# EAGLE design bpf-IF-SAW-856930 (EAGLE 9.2.2)
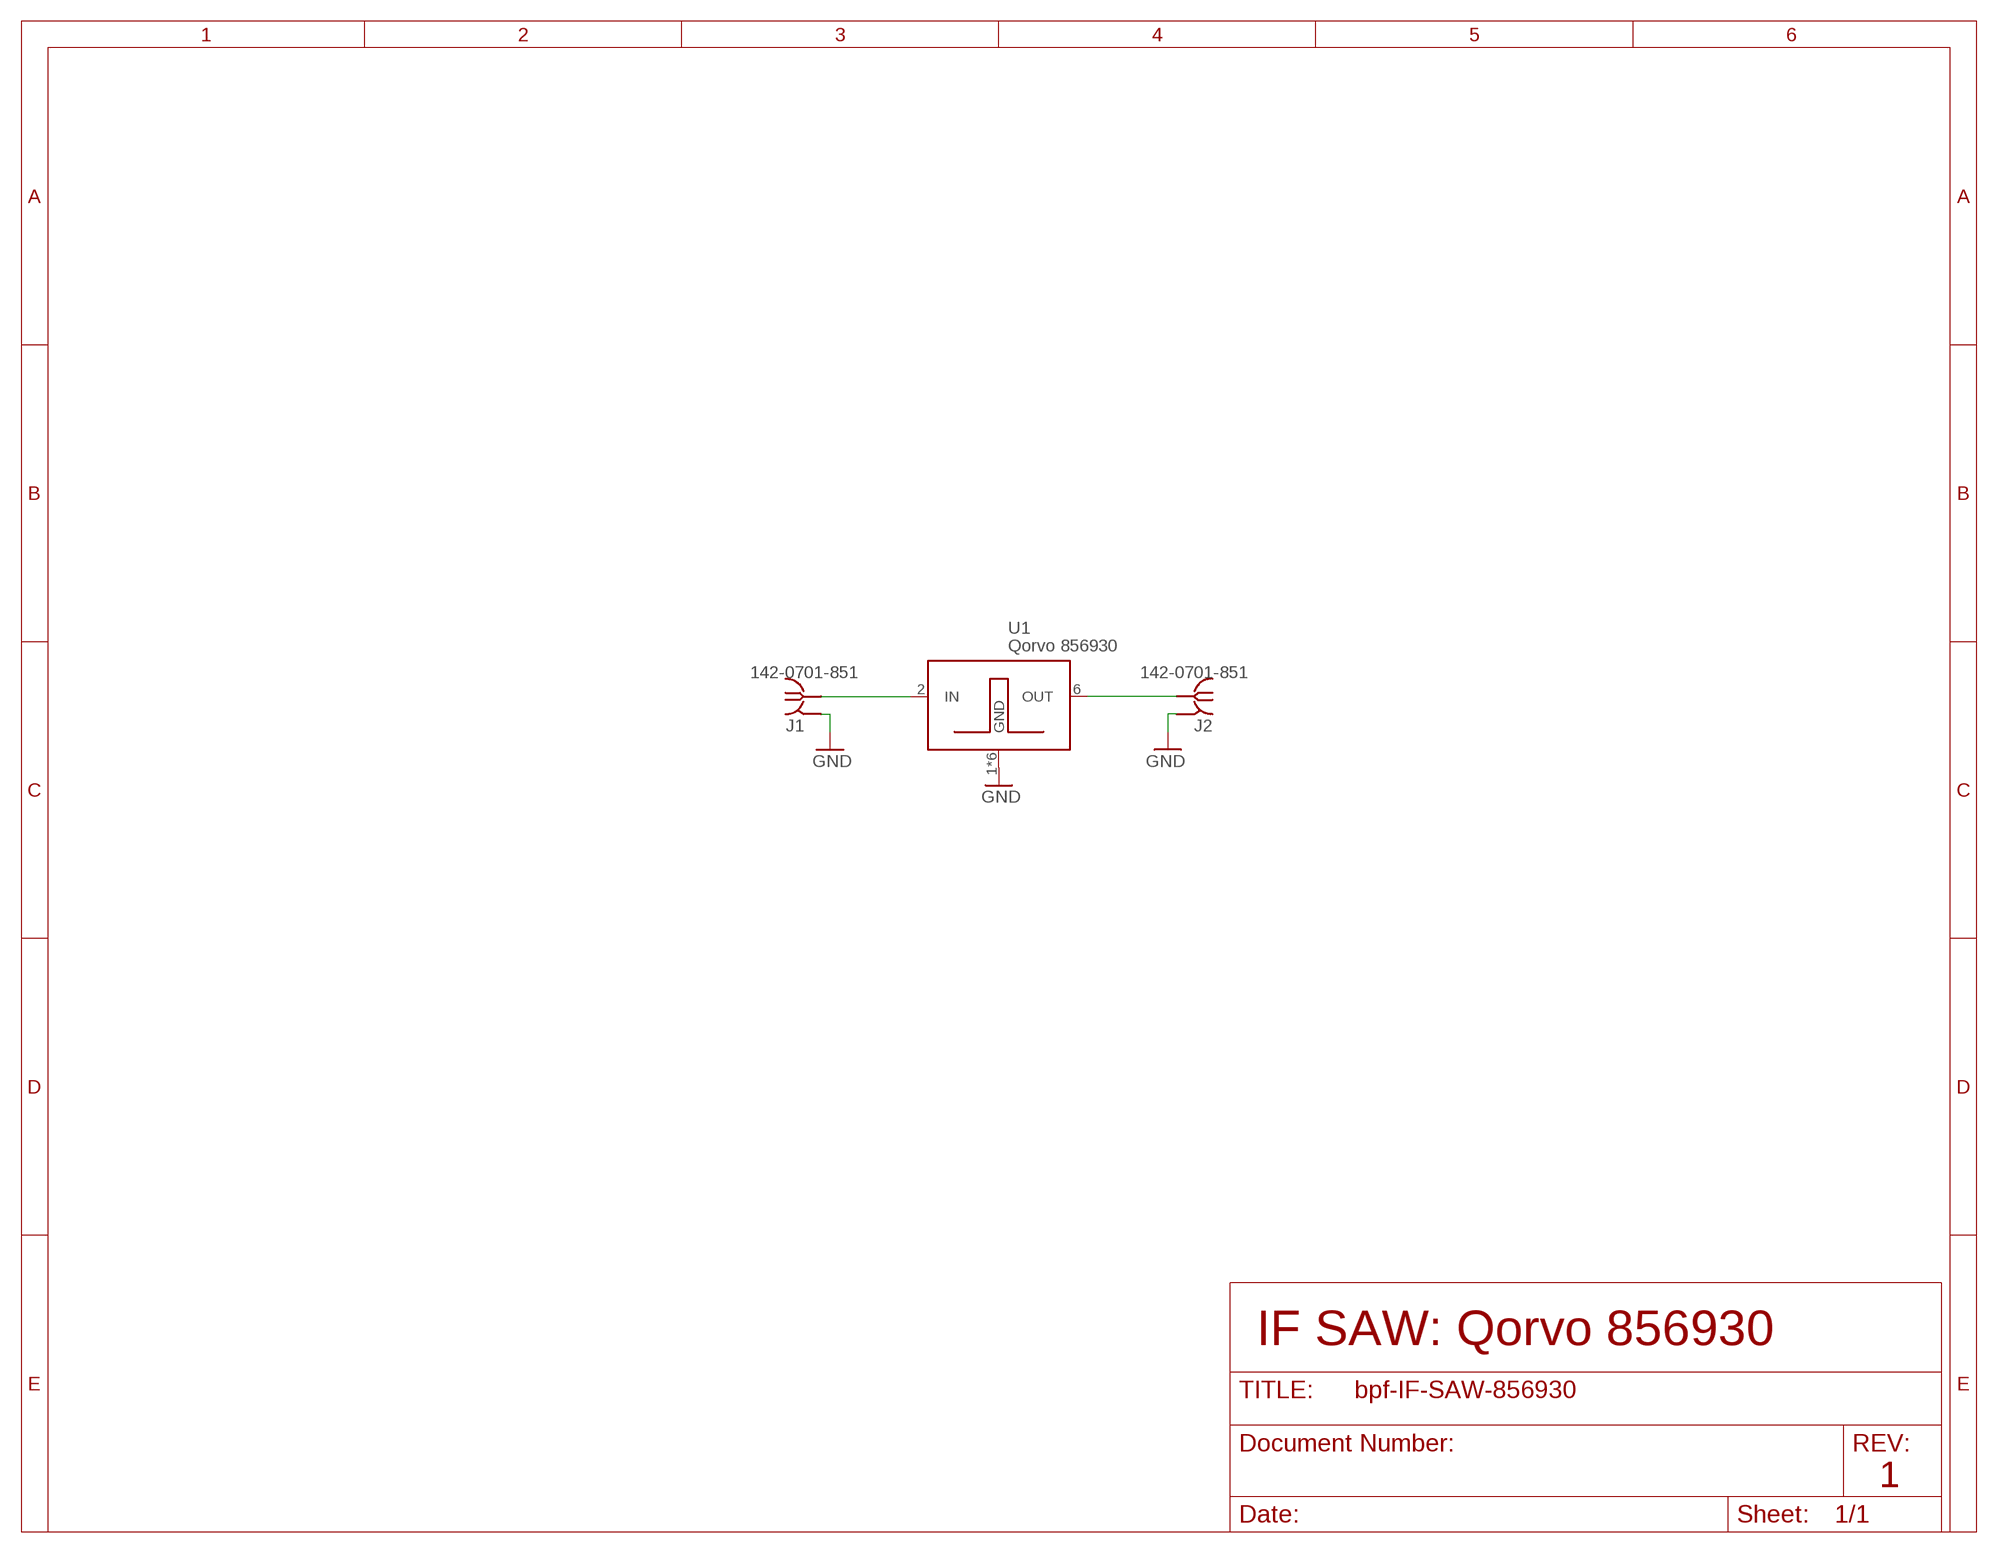
[diagram p0: schematic, sheet 1]

## Parts
J1  142-0701-851  [142-0701-851]
J2  142-0701-851  [142-0701-851]
U1  Qorvo 856930  856930  [3.8X3.8]

## Nets
GND: J1.GND1(GND) J1.GND2(GND) J1.GND3(GND) J1.GND4(GND) J2.GND1(GND) J2.GND2(GND) J2.GND3(GND) J2.GND4(GND) U1.1(GND) U1.3(GND) U1.4(GND) U1.5(GND) U1.7(GND) U1.8(GND)
N$86 [RF]: J1.RF1(RF) U1.2(IN)
N$87 [RF]: J2.RF1(RF) U1.6(OUT)

## Notes on the sheet
- IF SAW: Qorvo 856930
- 1

## Library data of the parts
J1 J2 = J-Cinch-142-0701-851-SMA-end-launch:142-0701-851: SMA Jack 50Ω - End Launch Source: Datasheet <https://belfuse.com/resources/productinformations/cinchconnectivitysolutions/johnson/pi-ccs-john-142-0701-851.pdf>
U1 = U-Qorvo-856930-SAW:856930: 457.5 MHz SAW Filter

## Net classes
1 RF: clearance 0.6 mm

## Board
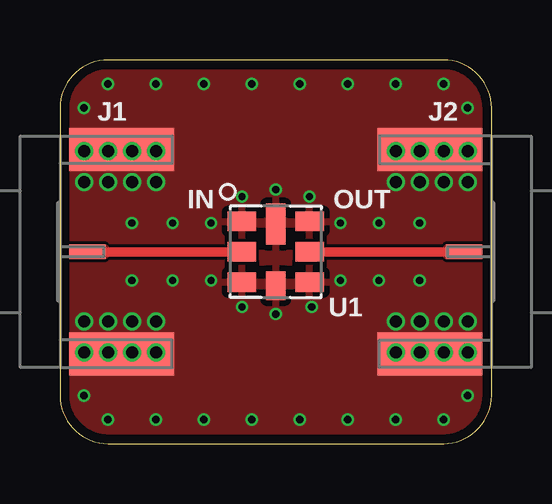
[diagram p1: board, top side]
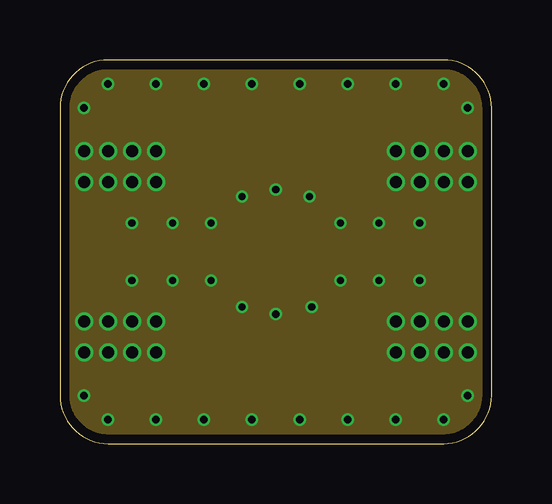
[diagram p2: board, inner layer Route2]
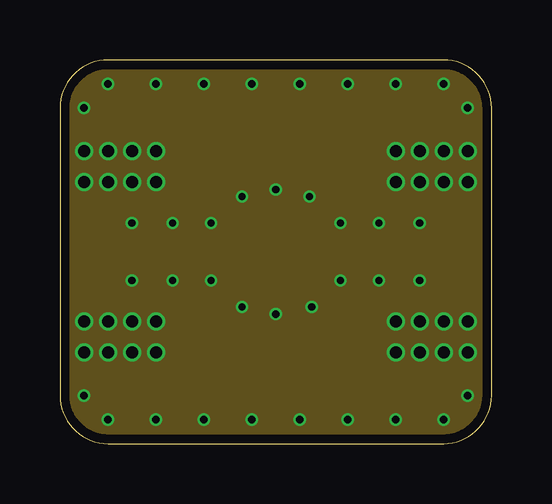
[diagram p3: board, inner layer Route15]
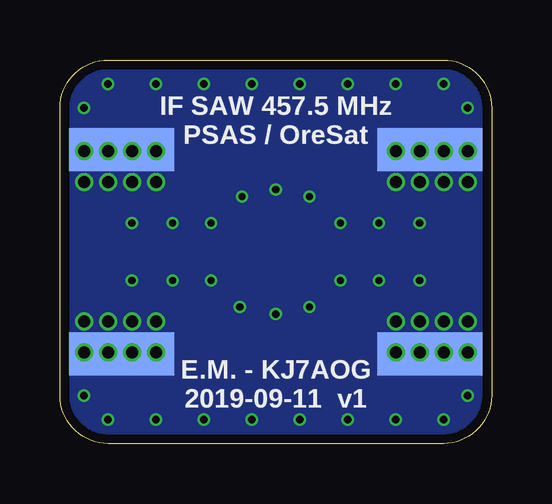
[diagram p4: board, bottom side, seen from below]

Size 18 x 16 mm. Coordinates in mm from the lower left corner, seen from the top.
Outline: 16,16 2,16 arc90 0,14 0,2 arc90 2,0 16,0 arc90 18,2 18,14 arc90 16,16
Copper layers (1*2*15*16): Top 0.035559375mm / dielectric 0.17018125mm / Route2 0.01778125mm / dielectric 47mil / Route15 0.01778125mm / dielectric 0.17018125mm / Bottom 0.035559375mm
Design rules "oshpark-4layer-tented": minimum track width 5mil, minimum drill 10mil, track to track 5mil, track to pad 5mil, pad to pad 5mil, via to via 5mil, smd to smd 5mil, copper to edge 15mil, drill to drill 6mil, minimum pad ring 4mil, minimum via ring 4mil, stop-mask expansion 2.5mil, vias tented up to drill 20mil, thermal gap 10mil

### Footprints (pad centres in the part's own frame; a part is rotated, then mirrored left to right if it is on the bottom)
142-0701-851 = smd 1.8 x 4.37: GND1 -4.255,-2.566; GND2 4.255,-2.566 | smd 1.8 x 4.37 bottom: GND3 -4.255,-2.566; GND4 4.255,-2.566 | smd 0.6 x 1.53: RF1 0,-1.146
3.8X3.8 = smd 1.19 x 0.81: 1 -1.41,1.27; 2 -1.41,0; 3 -1.41,-1.27; 5 1.41,-1.27; 6 1.41,0; 7 1.41,1.27 | smd 0.81 x 1.19: 4 0,-1.41 | smd 0.81 x 1.7: 8 0,1.155

### Placement (x,y rotation side)
J1  0,8 90 top
J2  18,8 270 top
U1  9,8 0 top

### Tracks (layer width: path | path; a pad name or v marks a point on that pad's centre or on a via)
GND  (via drill 0.3, 0.5)
  other vias: 1,3.8 2,3.8 3,3.8 4,3.8 1,5.1 2,5.1 3,5.1 4,5.1 1,12.2 2,12.2 3,12.2 4,12.2 1,10.9 2,10.9 3,10.9 4,10.9 14,3.8 15,3.8 16,3.8 17,3.8 17,5.1 16,5.1 15,5.1 14,5.1 14,12.2 15,12.2 16,12.2 17,12.2 14,10.9 15,10.9 16,10.9 17,10.9 3,6.8 4.7,6.8 6.3,6.8 6.3,9.2 3,9.2 4.7,9.2 11.7,9.2 11.7,6.8 15,6.8 15,9.2 13.3,9.2 13.3,6.8 7.6,5.7 10.5,5.7 9,5.4 9,10.6 10.4,10.3 7.6,10.3 1,2 2,1 4,1 6,1 8,1 10,1 12,1 14,1 16,1 17,2 1,14 2,15 4,15 6,15 8,15 10,15 12,15 14,15 16,15 17,14
  pour Top: 0,16 18,16 18,0 0,0
  pour Top (no thermals): 0,13.5 5,13.5 5,2.5 0,2.5
  pour Top (no thermals): 13,13.5 18,13.5 18,2.5 13,2.5
  pour Bottom: 0,16 18,16 18,0 0,0
  pour Route15: 0,16 18,16 18,0 0,0
  pour Route2: 0,16 18,16 18,0 0,0
  pour Bottom (no thermals): 0,13.5 5,13.5 5,2.5 0,2.5
  pour Bottom (no thermals): 13,13.5 18,13.5 18,2.5 13,2.5
N$86
  Top 0.39: J1.RF1 U1.2
  pour Top (no thermals): 1.5,8.2 1.9,8.2 2.1,8 1.9,7.8 1.5,7.8
N$87
  Top 0.39: J2.RF1 U1.6
  pour Top (no thermals): 16.4,8.2 16.1,8.2 15.9,8 16.1,7.8 16.4,7.8

### Text on the board
tPlace: IN | OUT
bPlace: IF SAW 457.5 MHz / PSAS / OreSat | E.M. - KJ7AOG / 2019-09-11 v1